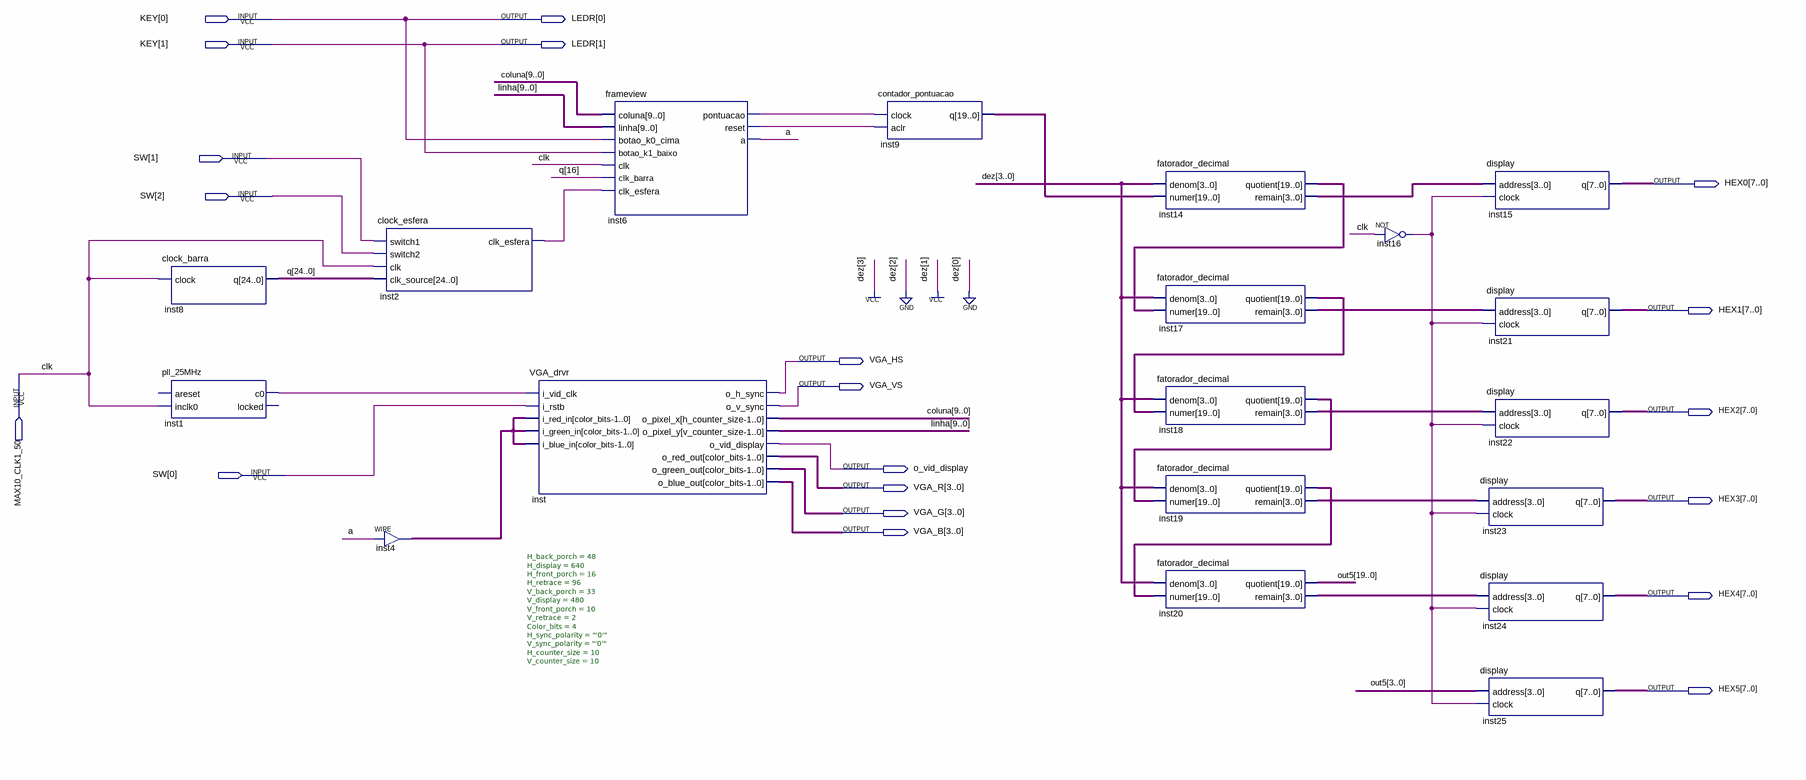
[diagram p0: schematic sheet]
// Quartus schematic vga1.bdf as structural Verilog: 19 symbols, 20 pins
module vga1 (
  input  [1:0] KEY,
  input  [2:0] SW,
  input  MAX10_CLK1_50,
  output [1:0] LEDR,
  output [7:0] HEX0,
  output [7:0] HEX1,
  output VGA_HS,
  output VGA_VS,
  output [7:0] HEX2,
  output o_vid_display,
  output [3:0] VGA_R,
  output [7:0] HEX3,
  output [3:0] VGA_G,
  output [3:0] VGA_B,
  output [7:0] HEX4,
  output [7:0] HEX5
);

  wire a, inst1_c0, inst2_clk_esfera, inst6_pontuacao, inst6_reset, inst16_out;
  wire [3:0] inst4_out, inst14_remain, inst17_remain, inst18_remain, inst19_remain, inst20_remain;
  wire [9:0] coluna, linha;
  wire [19:0] inst9_q, inst14_quotient, inst17_quotient, inst18_quotient, inst19_quotient, out5;
  wire [24:0] q;

  clock_barra inst8 (.clock(MAX10_CLK1_50), .q(q));
  pll_25MHz inst1 (.inclk0(MAX10_CLK1_50), .c0(inst1_c0));  // open: areset, locked
  clock_esfera inst2 (
    .switch1(SW[1]), .switch2(SW[2]), .clk(MAX10_CLK1_50), .clk_source(q), .clk_esfera(inst2_clk_esfera));
  assign inst4_out = {4{a}};  // WIRE inst4
  VGA_drvr #(.H_back_porch(48), .H_display(640), .H_front_porch(16), .H_retrace(96), .V_back_porch(33), .V_display(480), .V_front_porch(10), .V_retrace(2), .Color_bits(4), .H_sync_polarity("'0'"), .V_sync_polarity("'0'"), .H_counter_size(10), .V_counter_size(10)) inst (
    .i_vid_clk(inst1_c0), .i_rstb(SW[0]), .i_red_in(inst4_out), .i_green_in(inst4_out),
    .i_blue_in(inst4_out), .o_h_sync(VGA_HS), .o_v_sync(VGA_VS), .o_pixel_x(coluna), .o_pixel_y(linha),
    .o_vid_display(o_vid_display), .o_red_out(VGA_R), .o_green_out(VGA_G), .o_blue_out(VGA_B));
  frameview inst6 (
    .coluna(coluna), .linha(linha), .botao_k0_cima(KEY[0]), .botao_k1_baixo(KEY[1]), .clk(MAX10_CLK1_50),
    .clk_barra(q[16]), .clk_esfera(inst2_clk_esfera), .pontuacao(inst6_pontuacao), .reset(inst6_reset), .a(a));
  contador_pontuacao inst9 (.clock(inst6_pontuacao), .aclr(inst6_reset), .q(inst9_q));
  fatorador_decimal inst14 (.denom(4'b1010), .numer(inst9_q), .quotient(inst14_quotient), .remain(inst14_remain));
  fatorador_decimal inst17 (
    .denom(4'b1010), .numer(inst14_quotient), .quotient(inst17_quotient), .remain(inst17_remain));
  fatorador_decimal inst18 (
    .denom(4'b1010), .numer(inst17_quotient), .quotient(inst18_quotient), .remain(inst18_remain));
  fatorador_decimal inst19 (
    .denom(4'b1010), .numer(inst18_quotient), .quotient(inst19_quotient), .remain(inst19_remain));
  fatorador_decimal inst20 (.denom(4'b1010), .numer(inst19_quotient), .quotient(out5), .remain(inst20_remain));
  not inst16 (inst16_out, MAX10_CLK1_50);
  display inst15 (.address(inst14_remain), .clock(inst16_out), .q(HEX0));
  display inst21 (.address(inst17_remain), .clock(inst16_out), .q(HEX1));
  display inst22 (.address(inst18_remain), .clock(inst16_out), .q(HEX2));
  display inst23 (.address(inst19_remain), .clock(inst16_out), .q(HEX3));
  display inst24 (.address(inst20_remain), .clock(inst16_out), .q(HEX4));
  display inst25 (.address(out5[3:0]), .clock(inst16_out), .q(HEX5));

  assign LEDR = KEY;

  // Other names for the same wires on the sheet: clk = MAX10_CLK1_50
endmodule
